# Altium schematic sheet ADC.SchDoc
size A; SheetNumber: 3; SheetTotal: 5
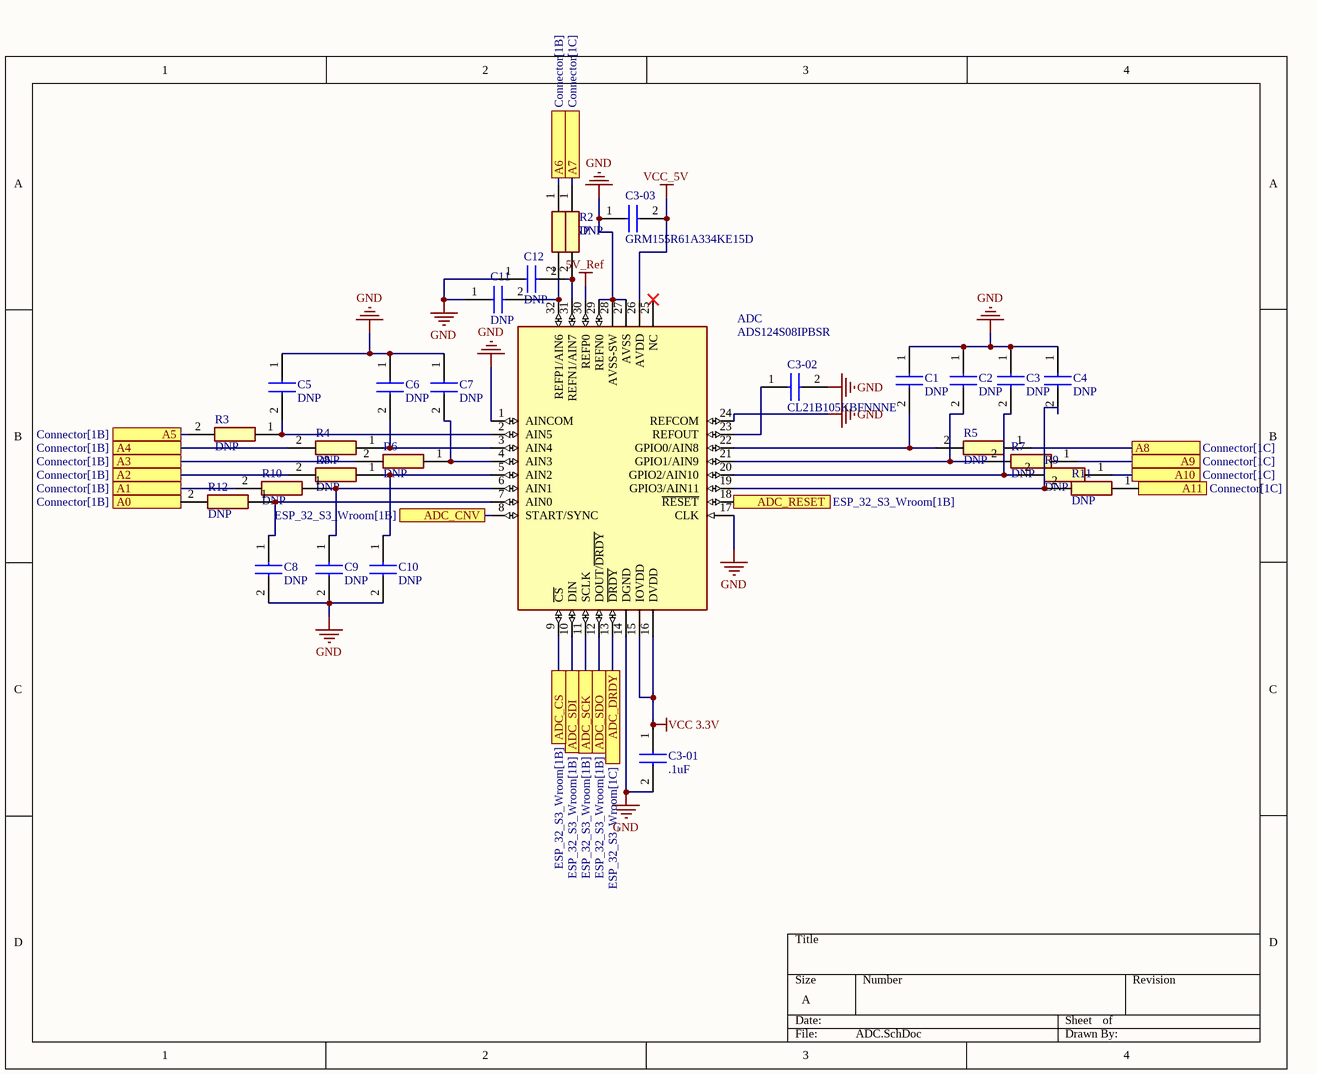
[diagram p0: ADC.SchDoc]

## Parts
ADC  ADS124S08IPBSR  [QFP50P700X700X120-32N]
C1  DNP  [C0402C104J4RACTU]
C2  DNP  [C0402C104J4RACTU]
C3  DNP  [C0402C104J4RACTU]
C3-01  .1uF  [CAPC2012X95N]
C3-02  CL21B105KBFNNNE  [CAPC2012X135N]
C3-03  GRM155R61A334KE15D  [CAPC1005X70N]
C4  DNP  [C0402C104J4RACTU]
C5  DNP  [C0402C104J4RACTU]
C6  DNP  [C0402C104J4RACTU]
C7  DNP  [C0402C104J4RACTU]
C8  DNP  [C0402C104J4RACTU]
C9  DNP  [C0402C104J4RACTU]
C10  DNP  [C0402C104J4RACTU]
C11  DNP  [C0402C104J4RACTU]
C12  DNP  [C0402C104J4RACTU]
R1  DNP  [RESC1005X40N]
R2  DNP  [RESC1005X40N]
R3  DNP  [RESC1005X40N]
R4  DNP  [RESC1005X40N]
R5  DNP  [RESC1005X40N]
R6  DNP  [RESC1005X40N]
R7  DNP  [RESC1005X40N]
R8  DNP  [RESC1005X40N]
R9  DNP  [RESC1005X40N]
R10  DNP  [RESC1005X40N]
R11  DNP  [RESC1005X40N]
R12  DNP  [RESC1005X40N]

## Ports
A0 (see Connector[1B]), A1 (see Connector[1B]), A2 (see Connector[1B]), A3 (see Connector[1B]), A4 (see Connector[1B]), A5 (see Connector[1B]), A6 (see Connector[1B]), A7 (see Connector[1C]), A8 (see Connector[1C]), A9 (see Connector[1C]), A10 (see Connector[1C]), A11 (see Connector[1C]), ADC_CNV (see ESP_32_S3_Wroom[1B]), ADC_CS (see ESP_32_S3_Wroom[1B]), ADC_DRDY (see ESP_32_S3_Wroom[1C]), ADC_RESET (see ESP_32_S3_Wroom[1B]), ADC_SCK (see ESP_32_S3_Wroom[1B]), ADC_SDI (see ESP_32_S3_Wroom[1B]), ADC_SDO (see ESP_32_S3_Wroom[1B])

## Nets
5V_Ref: ADC.30(REFP0)
GND: ADC.1(AINCOM) ADC.14(DGND) ADC.17(CLK) ADC.24(REFCOM) ADC.27(AVSS) ADC.28(AVSS-SW) ADC.29(REFN0) C1.1 C2.1 C3.1 C3-01.2 C3-02.2 C3-03.1 C4.1 C5.1 C6.1 C7.1 C8.2 C9.2 C10.2 C11.1 C12.1
VCC 3.3V: ADC.15(IOVDD) ADC.16(DVDD) C3-01.1
VCC_5V: ADC.26(AVDD) C3-03.2
A0: R12.2 ; port A0
A1: R10.2 ; port A1
A2: R8.2 ; port A2
A3: R6.2 ; port A3
A4: R4.2 ; port A4
A5: R3.2 ; port A5
A6: R1.1 ; port A6
A7: R2.1 ; port A7
A8: R5.1 ; port A8
A9: R7.1 ; port A9
A10: R9.1 ; port A10
A11: R11.1 ; port A11
ADC_CNV: ADC.8(START/SYNC) ; port ADC_CNV
ADC_CS: ADC.9(~{CS}) ; port ADC_CS
ADC_DRDY: ADC.13(~{DRDY}) ; port ADC_DRDY
ADC_RESET: ADC.18(~{RESET}) ; port ADC_RESET
ADC_SCK: ADC.11(SCLK) ; port ADC_SCK
ADC_SDI: ADC.10(DIN) ; port ADC_SDI
ADC_SDO: ADC.12(DOUT/~{DRDY}) ; port ADC_SDO
NetADC_2: ADC.2(AIN5) C5.2 R3.1
NetADC_3: ADC.3(AIN4) C6.2 R4.1
NetADC_4: ADC.4(AIN3) C7.2 R6.1
NetADC_5: ADC.5(AIN2) C10.1 R8.1
NetADC_6: ADC.6(AIN1) C9.1 R10.1
NetADC_7: ADC.7(AIN0) C8.1 R12.1
NetADC_19: ADC.19(GPIO3/AIN11) C4.2 R11.2
NetADC_20: ADC.20(GPIO2/AIN10) C3.2 R9.2
NetADC_21: ADC.21(GPIO1/AIN9) C2.2 R7.2
NetADC_22: ADC.22(GPIO0/AIN8) C1.2 R5.2
NetADC_23: ADC.23(REFOUT) C3-02.1
NetADC_31: ADC.31(REFN1/AIN7) C12.2 R2.2
NetADC_32: ADC.32(REFP1/AIN6) C11.2 R1.2

Not connected (* = marked no-connect by the designer): ADC 25(NC)*

## Library data of the parts
ADC = ADS124S08IPBSR: Integrated Circuit; Manufacturer_Name: Texas Instruments; Datasheet Link: http://www.ti.com/lit/gpn/ads124s08; Height: 1.2mm; Manufacturer_Part_Number: ADS124S08IPBSR; Mouser Part Number: 595-ADS124S08IPBSR; Mouser Price/Stock: https://www.mouser.co.uk/ProductDetail/Texas-Instruments/ADS124S08IPBSR?qs=Bho%2FbeBaDEw8zBU%2F9K2heg%3D%3D; Arrow Part Number: ADS124S08IPBSR; Arrow Price/Stock: https://www.arrow.com/en/products/ads124s08ipbsr/texas-instruments?utm_currency=USD&region=nac
C1-C12 = C0402C105K9PACTU: Capacitor; Manufacturer_Name: Yageo Group; Datasheet Link: https://content.kemet.com/datasheets/KEM_C1002_X7R_SMD.pdf; Height: 0.55mm; Manufacturer_Part_Number: C0402C105K9PACTU; Mouser Part Number: 80-C0402C105K9P; Mouser Price/Stock: https://www.mouser.co.uk/ProductDetail/KEMET/C0402C105K9PACTU?qs=UdQET6xYxVCMExqTDkuPeQ%3D%3D; Arrow Part Number: C0402C105K9PACTU; Arrow Price/Stock: https://www.arrow.com/en/products/c0402c105k9pactu/kemet-corporation?region=nac
C3-01 = CL21B104KBCNNNC: Capacitor; Manufacturer_Name: SAMSUNG; Datasheet Link: https://datasheet.datasheetarchive.com/originals/distributors/Datasheets_SAMA/86a3eaf0882763ef32124d5901f9b833.pdf; Height: 0.95mm; Manufacturer_Part_Number: CL21B104KBCNNNC; Mouser Part Number: 187-CL21B104KBCNNNC; Mouser Price/Stock: https://www.mouser.co.uk/ProductDetail/Samsung-Electro-Mechanics/CL21B104KBCNNNC?qs=349EhDEZ59pEfpnm5yBEmQ%3D%3D; Arrow Part Number: CL21B104KBCNNNC; Arrow Price/Stock: https://www.arrow.com/en/products/cl21b104kbcnnnc/samsung-electro-mechanics?region=europe
C3-02 = CL21B105KBFNNNE: Capacitor; Manufacturer_Name: SAMSUNG; Datasheet Link: https://componentsearchengine.com/Datasheets/2/CL21B105KBFNNNE.pdf; Height: 1.35mm; Manufacturer_Part_Number: CL21B105KBFNNNE; Mouser Part Number: 187-CL21B105KBFNNNE; Mouser Price/Stock: https://www.mouser.co.uk/ProductDetail/Samsung-Electro-Mechanics/CL21B105KBFNNNE?qs=yOVawPpwOwmddQEBPU6Y9A%3D%3D; Arrow Part Number: CL21B105KBFNNNE; Arrow Price/Stock: https://www.arrow.com/en/products/cl21b105kbfnnne/samsung-electro-mechanics?utm_currency=USD&region=europe
C3-03 = GRM155R61A334KE15D: Capacitor; Manufacturer_Name: Murata Electronics; Datasheet Link: https://search.murata.co.jp/Ceramy/image/img/A01X/G101/ENG/GRM155R61A334KE15-01A.pdf; Height: 0.7mm; Manufacturer_Part_Number: GRM155R61A334KE15D; Mouser Part Number: 81-GRM155R61A334KE5D; Mouser Price/Stock: https://www.mouser.co.uk/ProductDetail/Murata-Electronics/GRM155R61A334KE15D?qs=CXkDzNJPO8gvOTRgdwZZsw%3D%3D; Arrow Part Number: GRM155R61A334KE15D; Arrow Price/Stock: https://www.arrow.com/en/products/grm155r61a334ke15d/murata-manufacturing?region=nac
R1-R12 = RC0402FR-071KL: Resistor; Manufacturer_Name: Yageo Group; Datasheet Link: https://yageogroup.com/products/Resistors/part/RC0402FR-071KL; Height: 0.4mm; Manufacturer_Part_Number: RC0402FR-071KL; Mouser Part Number: 603-RC0402FR-071KL; Mouser Price/Stock: https://www.mouser.co.uk/ProductDetail/YAGEO/RC0402FR-071KL?qs=V1yeUXFNrknDEmWLmm5v6g%3D%3D; Arrow Part Number: RC0402FR-071KL; Arrow Price/Stock: https://www.arrow.com/en/products/rc0402fr-071kl/yageo.html?utm_currency=USD&region=europe